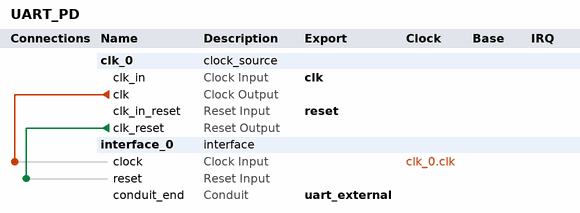
[diagram p0: system contents]
# Platform Designer (Qsys) system UART_PD, MAX 10 10M50DAF484C7G
# Parameters at their usual value, and those the tool derives, are not listed.
package require -exact qsys 18.1
create_system UART_PD
set_project_property DEVICE_FAMILY {MAX 10}
set_project_property DEVICE 10M50DAF484C7G

add_instance clk_0 clock_source 18.1
set_instance_parameter_value clk_0 clockFrequency 50000000

add_instance interface_0 interface 1.0
set_instance_parameter_value interface_0 baud_rate 9600
set_instance_parameter_value interface_0 clk_freq 5000000
set_instance_parameter_value interface_0 data_bits 8
set_instance_parameter_value interface_0 fifo_size 16
set_instance_parameter_value interface_0 parity_en false
set_instance_parameter_value interface_0 stop_bits 1

# connections
add_connection clk_0.clk interface_0.clock clock
add_connection clk_0.clk_reset interface_0.reset reset

# exported interfaces
add_interface clk clock sink
set_interface_property clk EXPORT_OF clk_0.clk_in
add_interface reset reset sink
set_interface_property reset EXPORT_OF clk_0.clk_in_reset
add_interface uart_external conduit end
set_interface_property uart_external EXPORT_OF interface_0.conduit_end

set_interconnect_requirement {$system} qsys_mm.clockCrossingAdapter HANDSHAKE
set_interconnect_requirement {$system} qsys_mm.enableEccProtection FALSE
set_interconnect_requirement {$system} qsys_mm.insertDefaultSlave FALSE
set_interconnect_requirement {$system} qsys_mm.maxAdditionalLatency 1

save_system UART_PD.qsys
